# EAGLE design Relais (EAGLE 7.4.0)
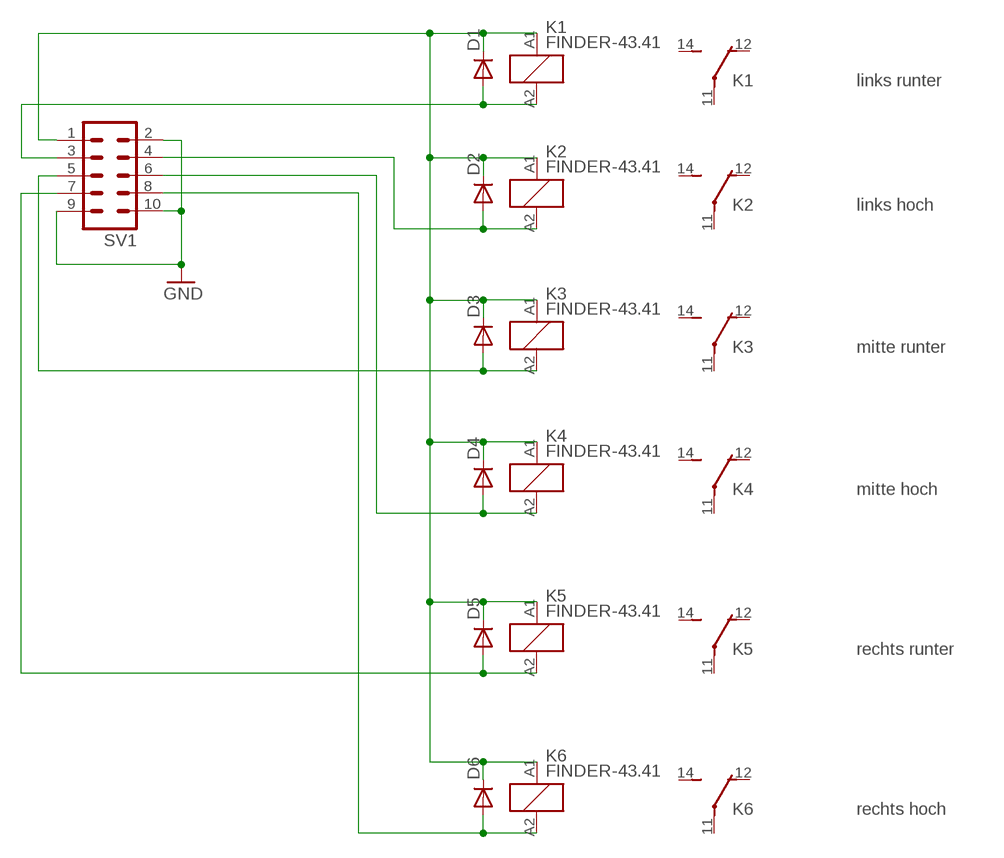
[diagram p0: schematic, sheet 1]

## Parts
D1  DIODE-D-7.5  [D-7.5]
D2  DIODE-D-7.5  [D-7.5]
D3  DIODE-D-7.5  [D-7.5]
D4  DIODE-D-7.5  [D-7.5]
D5  DIODE-D-7.5  [D-7.5]
D6  DIODE-D-7.5  [D-7.5]
K1  FINDER-43.41  [FINDER-43.41]
K2  FINDER-43.41  [FINDER-43.41]
K3  FINDER-43.41  [FINDER-43.41]
K4  FINDER-43.41  [FINDER-43.41]
K5  FINDER-43.41  [FINDER-43.41]
K6  FINDER-43.41  [FINDER-43.41]
SV1  ML10  [ML10]

## Nets
GND: SV1.2 SV1.9 SV1.10
N$1: D1.A K1.A2 SV1.3
N$2: D2.A K2.A2 SV1.4
N$3: D3.A K3.A2 SV1.5
N$4: D4.A K4.A2 SV1.6
N$5: D5.A K5.A2 SV1.7
N$6: D6.A K6.A2 SV1.8
VCC: D1.C D2.C D3.C D4.C D5.C D6.C K1.A1 K2.A1 K3.A1 K4.A1 K5.A1 K6.A1 SV1.1
Unconnected: K1.11(-2:P) K1.12(-2:O) K1.14(-2:S) K2.11(-2:P) K2.12(-2:O) K2.14(-2:S) K3.11(-2:P) K3.12(-2:O) K3.14(-2:S) K4.11(-2:P) K4.12(-2:O) K4.14(-2:S) K5.11(-2:P) K5.12(-2:O) K5.14(-2:S) K6.11(-2:P) K6.12(-2:O) K6.14(-2:S)

## Notes on the sheet
- links runter
- links hoch
- mitte runter
- mitte hoch
- rechts runter
- rechts hoch

## Library data of the parts
D1-D6 = diode:DIODE-: DIODE
K1-K6 = relay_fin4341:FINDER-43.41: SUBMINIATURE DIL-RELAIS FINDER 43.41.7.005.0000 Kontakt max. AC - 250V 10A
SV1 = con-harting-ml:ML10: HARTING; OC_FARNELL: unknown; OC_NEWARK: unknown

## Board
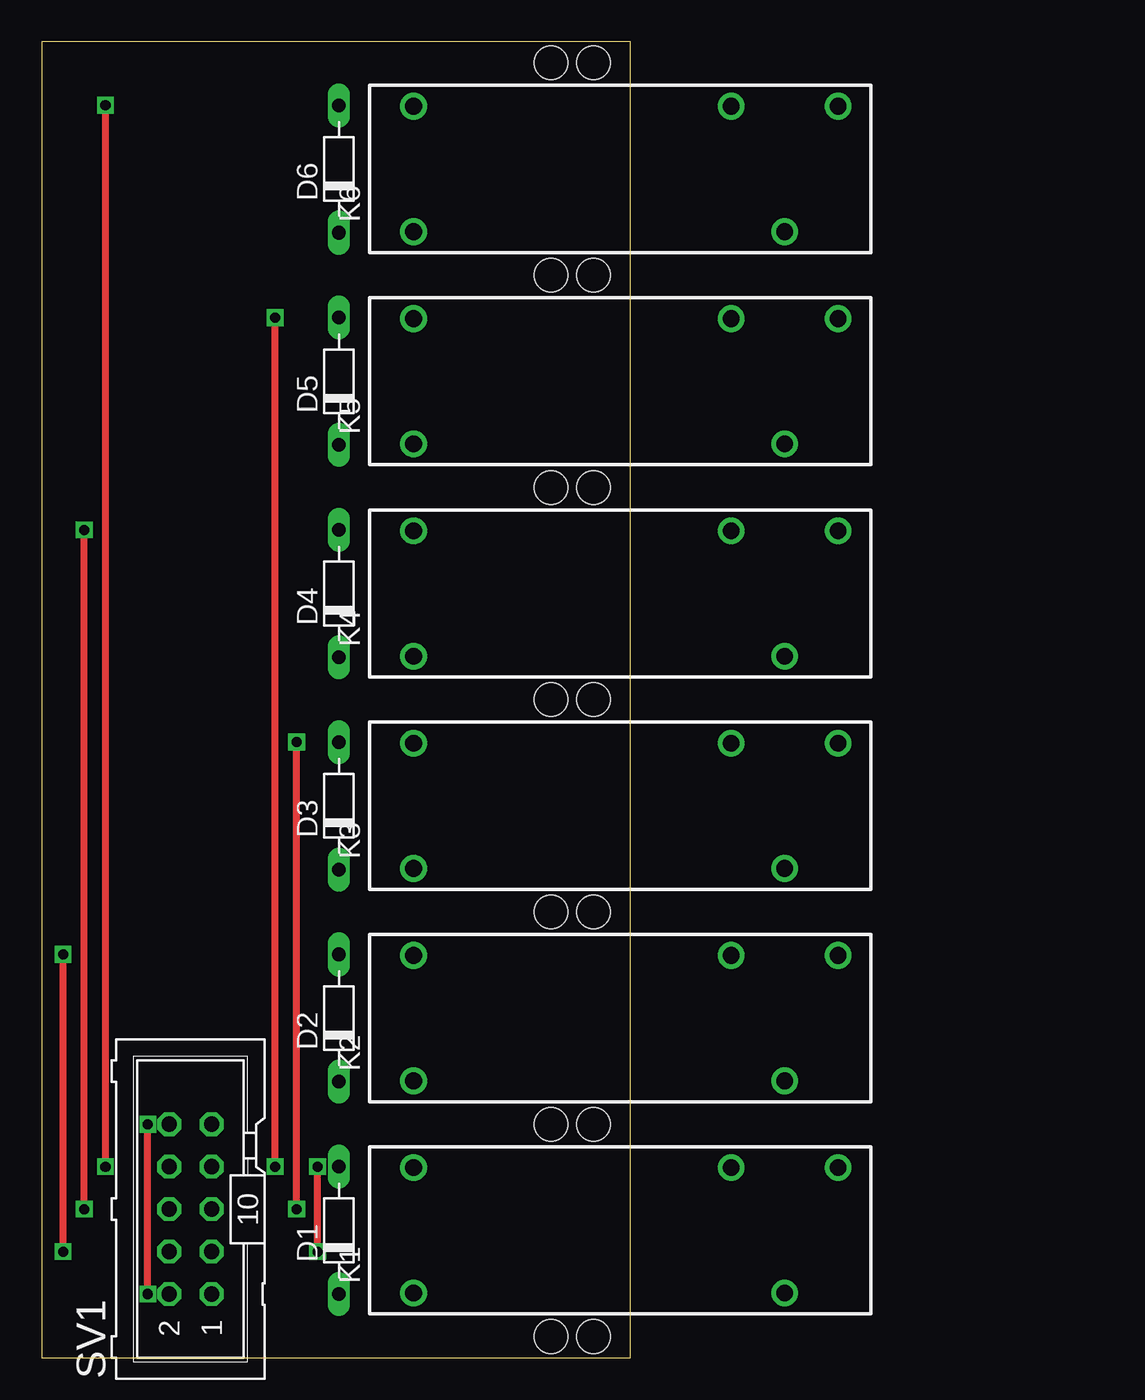
[diagram p1: board, top side]
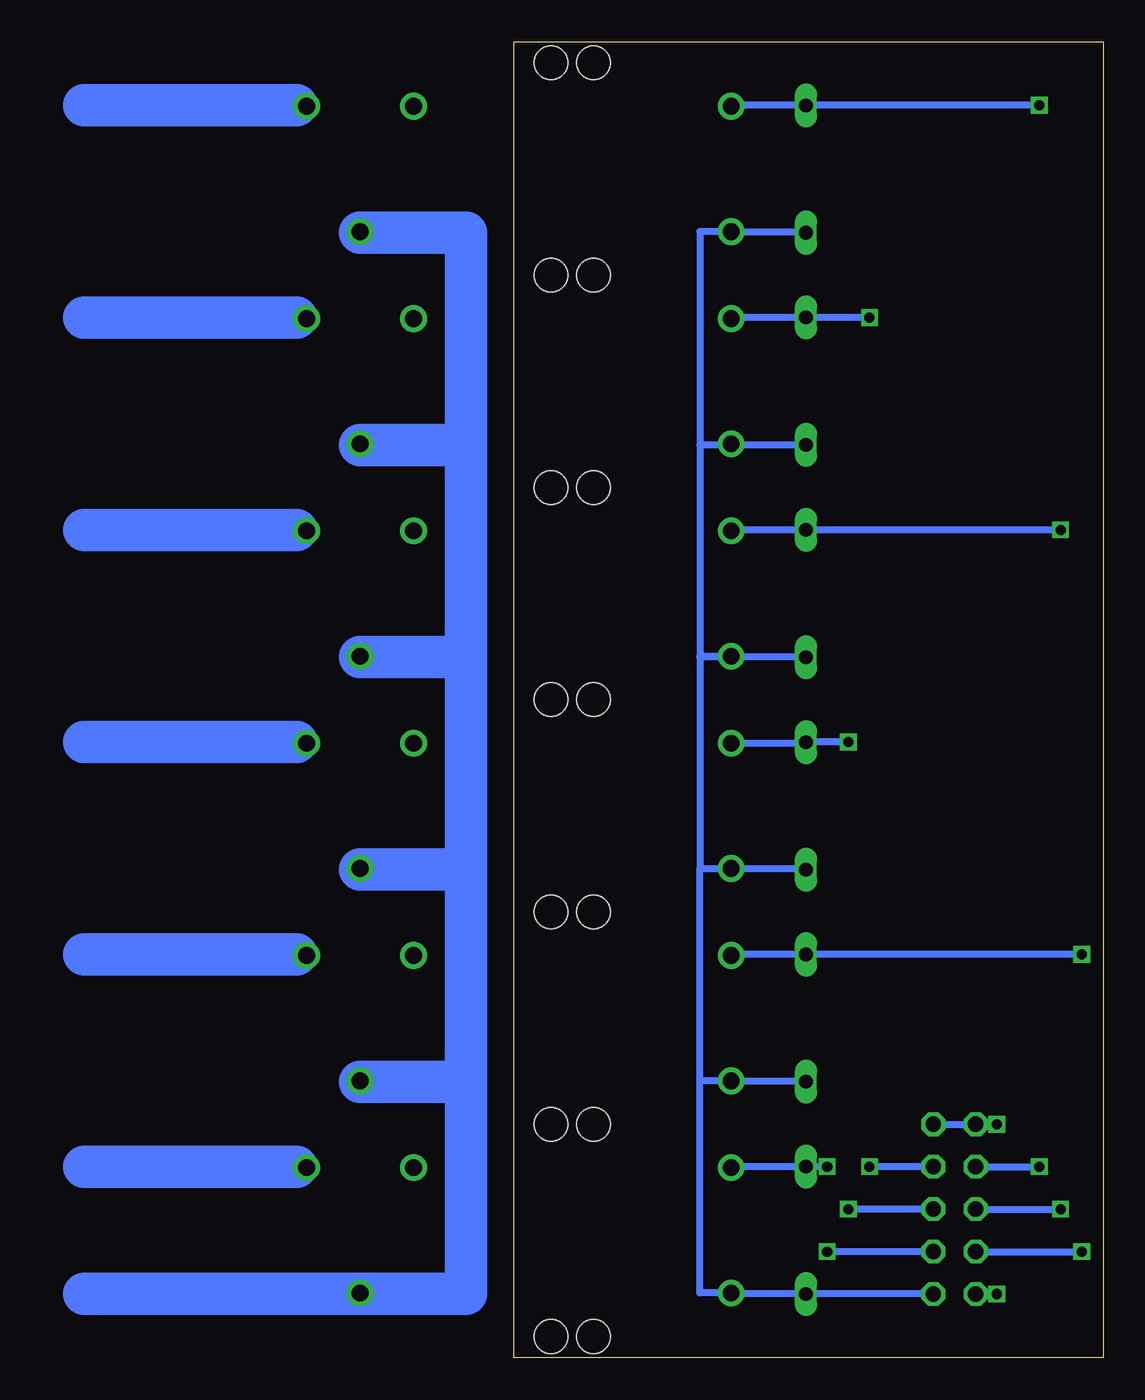
[diagram p2: board, bottom side, seen from below]

Size 35.23 x 78.73 mm. Coordinates in mm from the lower left corner, seen from the top.
Outline: 0,0 35.23,0 35.23,78.73 0,78.73 0,0
Copper layers (1*16): Top 0.035mm / dielectric 1.5mm / Bottom 0.035mm
Design rules "default": minimum track width 10mil, minimum drill 24mil, track to track 8mil, track to pad 8mil, pad to pad 8mil, via to via 8mil, smd to smd 8mil, copper to edge 40mil, drill to drill 8mil, minimum pad ring 10mil, minimum via ring 8mil, stop-mask expansion 4mil, vias tented up to drill 0mil, thermal gap 10mil
Holes 2 mm at 33.02,77.47 33.02,64.77 33.02,52.07 33.02,39.37 33.02,26.67 33.02,13.97 33.02,1.27 30.48,64.77 30.48,52.07 30.48,39.37 30.48,26.67 30.48,13.97 30.48,1.27 30.48,77.47

### Footprints (pad centres in the part's own frame; a part is rotated, then mirrored left to right if it is on the bottom)
D-7.5 = drill 0.813 long: A 3.81,0; C -3.81,0
FINDER-43.41 = drill 1 pad 1.6: 11 0,-3.75; 12 -3.2,3.75; 14 3.2,3.75; A1 -22.2,-3.75; A2 -22.2,3.75
ML10 = drill 0.914 octagon: 1 -5.08,-1.27; 2 -5.08,1.27; 3 -2.54,-1.27; 4 -2.54,1.27; 5 0,-1.27; 6 0,1.27; 7 2.54,-1.27; 8 2.54,1.27; 9 5.08,-1.27; 10 5.08,1.27

### Placement (x,y rotation side)
D1  17.78,7.62 90 top
D2  17.78,20.32 90 top
D3  17.78,33.02 90 top
D4  17.78,45.72 90 top
D5  17.78,58.42 90 top
D6  17.78,71.12 90 top
K1  44.45,7.62 0 top
K2  44.45,20.32 0 top
K3  44.45,33.02 0 top
K4  44.45,45.72 0 top
K5  44.45,58.42 0 top
K6  44.45,71.12 0 top
SV1  8.89,8.89 90 top

### Tracks (layer width: path | path; a pad name or v marks a point on that pad's centre or on a via)
GND  (via drill 0.6)
  Top 0.406: v6.35,3.81 v6.35,13.97
  Bottom 0.406: SV1.9 SV1.10 v6.35,13.97 | SV1.2 v6.35,3.81
N$1  (via drill 0.6)
  Top 0.406: v16.51,6.35 v16.51,11.43
  Bottom 0.406: K1.A2 22.25,11.43 D1.A v16.51,11.43 | SV1.3 v16.51,6.35
N$2  (via drill 0.6)
  Top 0.406: v1.27,6.35 v1.27,24.13
  Bottom 0.406: K2.A2 22.25,24.13 D2.A v1.27,24.13 | SV1.4 v1.27,6.35
N$3  (via drill 0.6)
  Top 0.406: v15.24,8.89 v15.24,36.83
  Bottom 0.406: K3.A2 17.78,36.77 D3.A v15.24,36.83 | SV1.5 v15.24,8.89
N$4  (via drill 0.6)
  Top 0.406: v2.54,8.89 v2.54,49.53
  Bottom 0.406: K4.A2 22.25,49.53 D4.A v2.54,49.53 | SV1.6 v2.54,8.89
N$5  (via drill 0.6)
  Top 0.406: v13.97,11.43 v13.97,62.23
  Bottom 0.406: K5.A2 22.25,62.23 D5.A v13.97,62.23 | SV1.7 v13.97,11.43
N$6  (via drill 0.6)
  Top 0.406: v3.81,11.43 v3.81,74.93
  Bottom 0.406: K6.A2 22.25,74.93 D6.A v3.81,74.93 | SV1.8 v3.81,11.43
N$8
  Bottom 2.54: 48.26,24.13 60.96,24.13
N$9
  Bottom 2.54: 48.26,11.43 60.96,11.43
N$10
  Bottom 2.54: 48.26,36.83 60.96,36.83
N$11
  Bottom 2.54: 48.26,49.53 60.96,49.53
N$12
  Bottom 2.54: 48.26,62.23 60.96,62.23
N$13
  Bottom 2.54: 48.26,74.93 60.96,74.93
N$14
  Bottom 2.54: 60.96,3.81 38.1,3.81 38.1,16.51 | 38.1,16.51 44.45,16.51 | 38.1,16.51 38.1,29.21 | 38.1,29.21 44.45,29.21 | 38.1,29.21 38.1,41.91 | 38.1,41.91 44.45,41.91 | 38.1,41.91 38.1,54.61 | 38.1,54.61 44.45,54.61 | 38.1,54.61 38.1,67.31 44.45,67.31
VCC
  Bottom 0.406: D6.C 17.78,67.37 K6.A1 24.13,67.37 24.13,54.61 | D5.C 22.25,54.61 | D4.C 22.25,41.91 | K5.A1 22.25,54.61 | 22.25,54.61 24.13,54.61 | 24.13,54.61 24.13,41.97 K4.A1 22.25,41.91 | 22.25,41.91 24.13,41.91 24.13,29.27 | 24.13,29.27 K3.A1 17.78,29.27 D3.C | 24.13,16.57 K2.A1 17.78,16.57 D2.C | 24.13,16.57 24.13,29.27 | 24.13,16.57 24.13,3.87 K1.A1 22.25,3.81 D1.C SV1.1